# EAGLE design RJ45AnalogEagle (EAGLE 6.2)
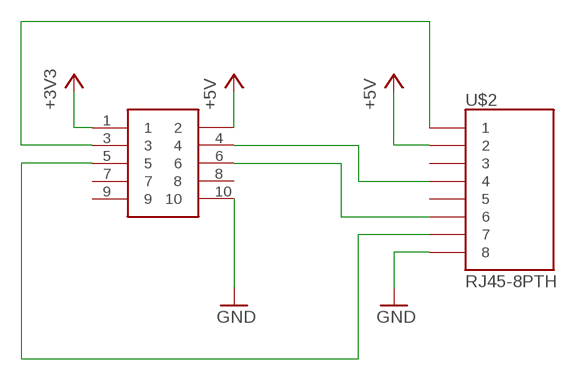
[diagram p0: schematic, sheet 1]

## Parts
U$1  SHF105SM  [SHF105DSM]
U$2  RJ45-8PTH  [RJ45-8]

## Nets
+3V3: U$1.1
+5V: U$1.2 U$2.2
AIN1: U$1.3 U$2.1
AIN2: U$1.4 U$2.4
AIN3: U$1.5 U$2.7
GND: U$1.10 U$2.8
GPIO: U$1.6 U$2.6
Unconnected: U$1.7 U$1.8 U$1.9 U$2.3 U$2.5

## Library data of the parts
U$1 = Gadgeteer:SHF105
U$2 = SparkFun-Connectors:RJ45-8: RJ45 Jack Simple RJ45, 8-pin connection - connector for common Cat5, Cat5e, and Cat6 Ethernet cables. Footprint not yet proven in production. Connector sku is PRT-00643; Breakout PCB sku is BOB-00716.

## Board
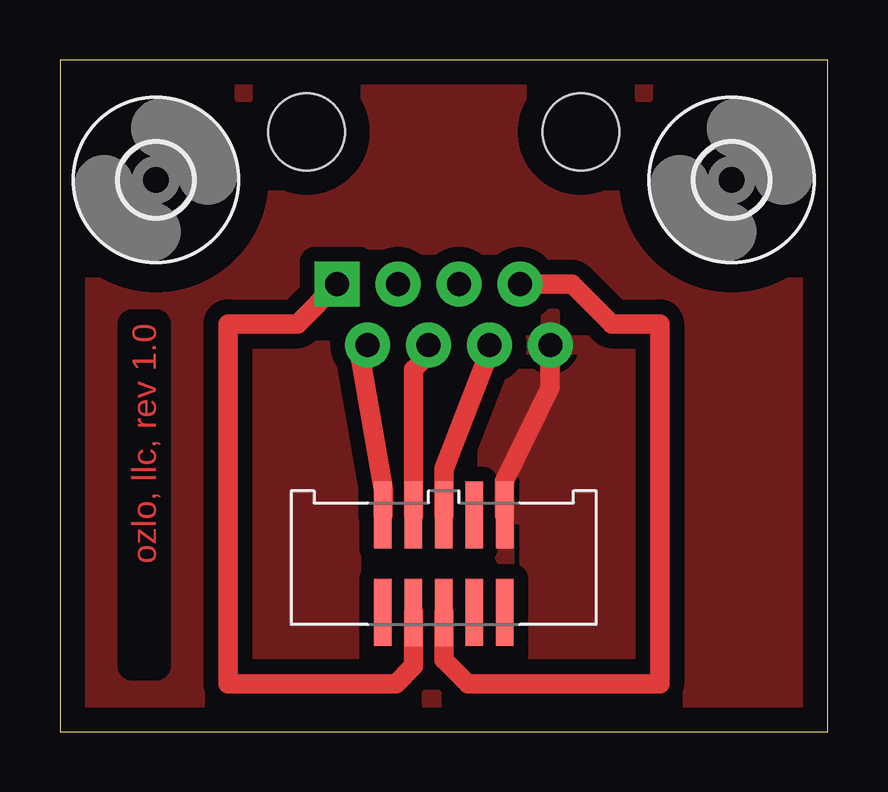
[diagram p1: board, top side]
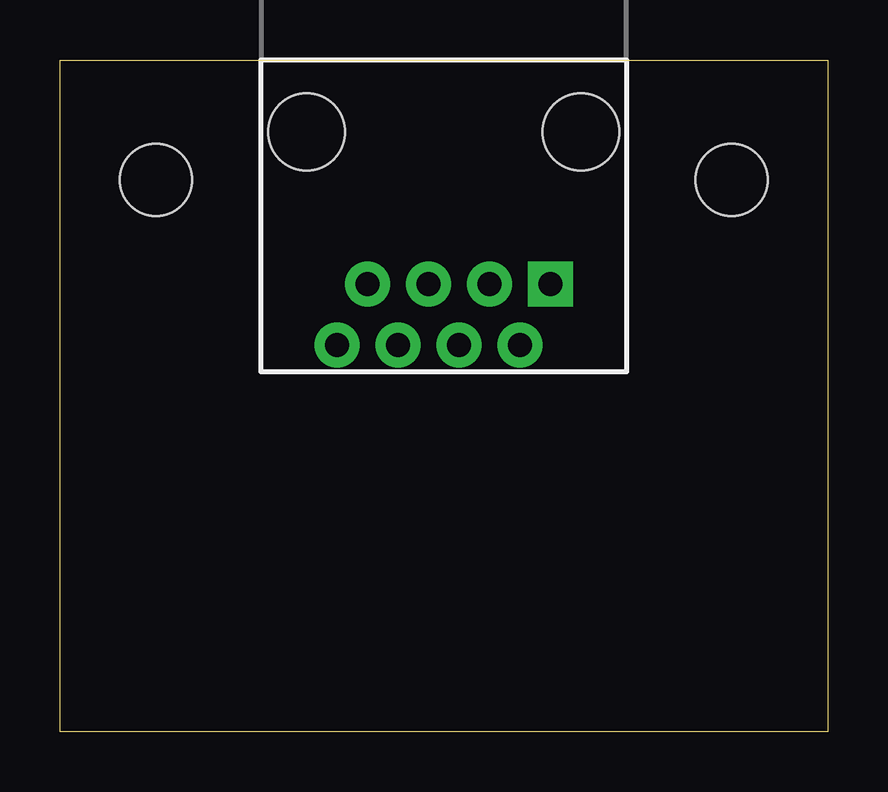
[diagram p2: board, bottom side, seen from below]

Size 32 x 28 mm. Coordinates in mm from the lower left corner, seen from the top.
Outline: 0,0 32,0 32,28 0,28 0,0
Copper layers (1*16): Top 0.035mm / dielectric 1.5mm / Bottom 0.035mm
Design rules: minimum track width 10mil, minimum drill 24mil, track to track 8mil, track to pad 8mil, pad to pad 8mil, via to via 8mil, smd to smd 8mil, copper to edge 40mil, drill to drill 8mil, minimum pad ring 10mil, minimum via ring 8mil, stop-mask expansion 4mil, vias tented up to drill 0mil, thermal gap 10mil

### Footprints (pad centres in the part's own frame; a part is rotated, then mirrored left to right if it is on the bottom)
SHF105DSM = smd 2.794 x 0.737: 1 -2.032,2.54; 2 2.032,2.54; 3 -2.032,1.27; 4 2.032,1.27; 5 -2.032,0; 6 2.032,0; 7 -2.032,-1.27; 8 2.032,-1.27; 9 -2.032,-2.54; 10 2.032,-2.54
RJ45-8 = drill 1 pad 1.88 square: 1 -4.445,6.35 | drill 1 pad 1.88: 2 -3.175,8.89; 3 -1.905,6.35; 4 -0.635,8.89; 5 0.635,6.35; 6 1.905,8.89; 7 3.175,6.35; 8 4.445,8.89 | hole 3.2: -5.715,0; 5.715,0
3,0 = hole 3: 0,0

### Placement (x,y rotation side)
U$1  16,7 90 top
U$2  16,25 180 bottom
U$3  [3,0]  4,23 0 top
U$4  [3,0]  28,23 0 top

### Tracks (layer width: path | path; a pad name or v marks a point on that pad's centre or on a via)
+5V
  Top 0.813: U$1.2 13.49,10.06 12.49,15.8 13.18,16.11 U$2.2
AIN1
  Top 0.813: U$1.3 14.73,2.73 14,2 8,2 7,2 7,17 9.9,17 U$2.1
AIN2
  Top 0.813: U$1.4 14.73,15.09 15.37,15.72 U$2.4
AIN3
  Top 0.813: U$2.7 21.35,18.65 23,17 25,17 25,2 17,2 16,3 U$1.5
GND
  Top 0.813: U$1.10 18.54,10.44 20.42,14.33 20.42,16.09 U$2.8
  pour Top (isolate 0.61): 0,28 32,28 32,0 0,0
GPIO
  Top 0.813: U$1.6 16,10.95 17.91,15.85 U$2.6

### Text on the board
Top: ozlo, llc, rev 1.0